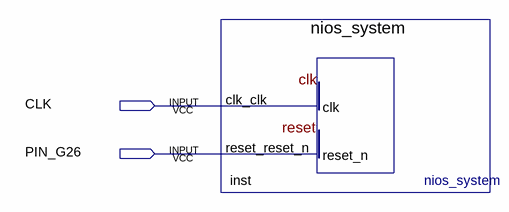
[diagram p0: schematic sheet]
// Quartus schematic Lab5Design.bdf as structural Verilog: 1 symbols, 2 pins
module Lab5Design (
  input  CLK,
  input  PIN_G26
);

  nios_system inst (.clk_clk(CLK), .reset_reset_n(PIN_G26));
endmodule
